# EAGLE design midiext-001 (EAGLE 8.6.3)
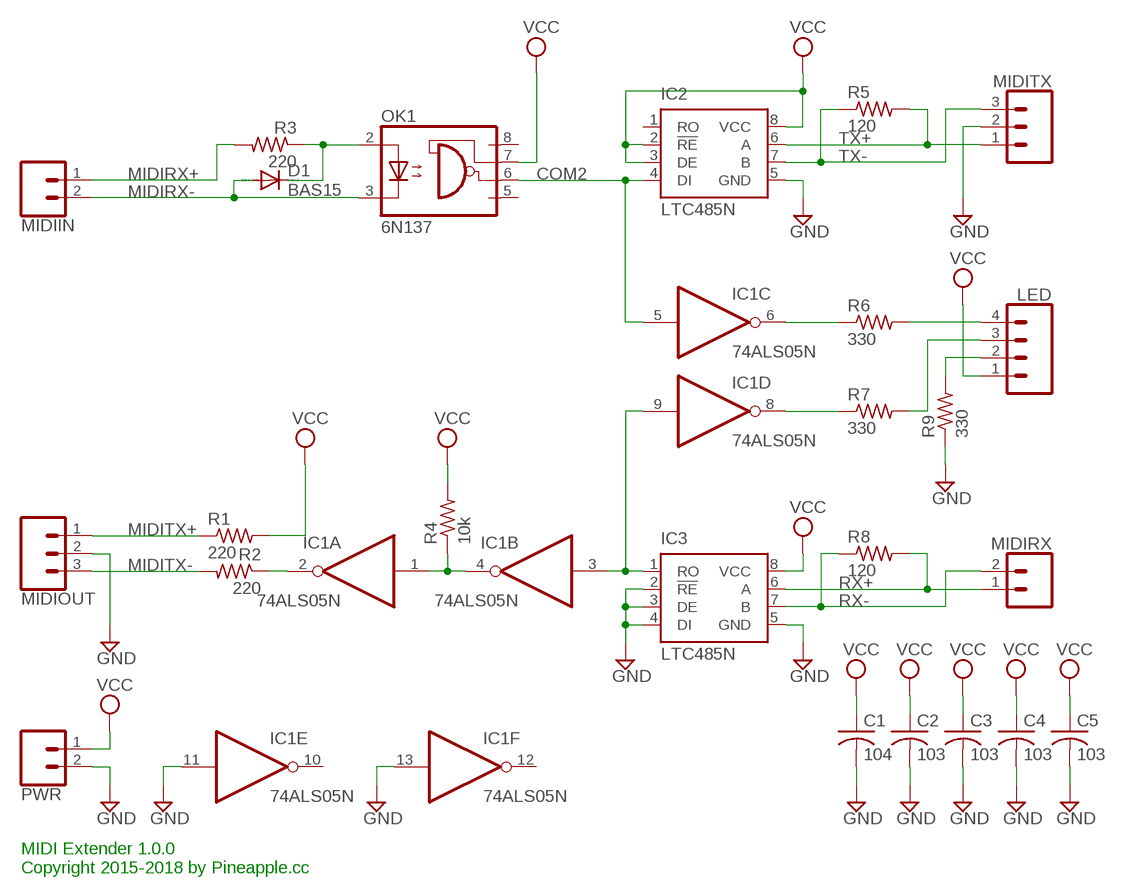
[diagram p0: schematic, sheet 1]

## Parts
C1  104  C-US025-025X050  [C025-025X050]
C2  103  C-US025-025X050  [C025-025X050]
C3  103  C-US025-025X050  [C025-025X050]
C4  103  C-US025-025X050  [C025-025X050]
C5  103  C-US025-025X050  [C025-025X050]
D1  BAS15  [DO34-7]
IC1  74ALS05N  [DIL14]
IC2  LTC485N  [DIL08]
IC3  LTC485N  [DIL08]
LED  CONN_04JST-PTH  [JST-4-PTH]
MIDIIN  CONN_02JST-PTH-2  [JST-2-PTH]
MIDIOUT  CONN_03JST-PTH  [JST-3-PTH]
MIDIRX  CONN_02JST-PTH-2  [JST-2-PTH]
MIDITX  CONN_03JST-PTH  [JST-3-PTH]
OK1  6N137  [DIL08]
PWR  CONN_02JST-PTH-2  [JST-2-PTH]
R1  220  R-US_0204/5  [0204/5]
R2  220  R-US_0204/5  [0204/5]
R3  220  R-US_0204/5  [0204/5]
R4  10k  R-US_0204/5  [0204/5]
R5  120  R-US_0204/5  [0204/5]
R6  330  R-US_0204/5  [0204/5]
R7  330  R-US_0204/5  [0204/5]
R8  120  R-US_0204/5  [0204/5]
R9  330  R-US_0204/5  [0204/5]

## Nets
COM2: IC1.5(C:I) IC2.4(DI) OK1.6(VO)
GND: C1.2 C2.2 C3.2 C4.2 C5.2 IC1.11(E:I) IC1.13(F:I) IC2.5(GND) IC3.2(!RE) IC3.3(DE) IC3.4(DI) IC3.5(GND) MIDIOUT.2 MIDITX.2 PWR.2 R9.1
MIDIRX+: MIDIIN.1 R3.2
MIDIRX-: D1.A MIDIIN.2 OK1.3(C)
MIDITX+: MIDIOUT.1 R1.1
MIDITX-: MIDIOUT.3 R2.2
N$1: IC1.3(B:I) IC1.9(D:I) IC3.1(RO)
N$2: IC1.2(A:O) R2.1
N$3: IC1.1(A:I) IC1.4(B:O) R4.1
N$6: IC1.6(C:O) R6.1
N$7: IC1.8(D:O) R7.1
N$8: LED.4 R6.2
N$9: LED.3 R7.2
N$10: LED.2 R9.2
N$15: D1.C OK1.2(A) R3.1
RX+: IC3.6(A) MIDIRX.1 R8.2
RX-: IC3.7(B) MIDIRX.2 R8.1
TX+: IC2.6(A) MIDITX.1 R5.2
TX-: IC2.7(B) MIDITX.3 R5.1
VCC: C1.1 C2.1 C3.1 C4.1 C5.1 IC2.2(!RE) IC2.3(DE) IC2.8(VCC) IC3.8(VCC) LED.1 OK1.7(VE) PWR.1 R1.2 R4.2
Unconnected: IC1.10(E:O) IC1.12(F:O) IC2.1(RO) OK1.5(GND) OK1.8(VCC)

## Notes on the sheet
- MIDI Extender 1.0.0
  Copyright 2015-2018 by Pineapple.cc

## Power pins joined to a net without a drawn wire
GND: IC1.7(P:GND)
VCC: IC1.14(P:VCC)

## Library data of the parts
C1-C5 = rcl:C-US: CAPACITOR, American symbol; SPICEPREFIX: C
D1 = diode:BAS15: DIODE high speed
IC1 = 74xx-eu:74*05: Hex INVERTER, open collector
IC2 IC3 = linear-technology:LTC485: Low Power RS485 Interface Transceiver Source: http://www.linear.com/pc/downloadDocument.do?navId=H0,C1,C1007,C1017,P2064,D1718; OC_FARNELL: unknown; OC_NEWARK: unknown
LED = SparkFun-Connectors:CONN_04: Multi connection point. Often used as Generic Header-pin footprint for 0.1 inch spaced/style header connections On any of the 0.1 inch spaced packages, you can populate with these: Break Away Headers - Straight <https://www.sparkfun.com/products/116> (PRT-00116) Break Away Male Headers - Right Angle <https://www.sparkfun.com/products/553> (PRT-00553) Female Headers <https://www.sparkfun.com/products/115> (PRT-00115) Break Away Headers - Machine Pin <https://www.sparkfun.com/products/117> (PRT-00117) Break Away Female Headers - Swiss Machine Pin <https://www.sparkfun.com/products/743> (PRT-00743) For SCREWTERMINALS and SPRING TERMINALS visit here: Screw Terimnals on SparkFun.com <https://www.sparkfun.com/search/results?term=Screw+Terminals> (5mm/3.5mm/2.54mm spacing) This device is also useful as a general connection point to wire up your design to another part of your project. Our various solder wires solder well into these plated through hole pads. Hook-Up Wire - Assortment (Stranded, 22 AWG) <https://www.sparkfun.com/products/11375> (PRT-11375) Hook-Up Wire - Assortment (Solid Core, 22 AWG) <https://www.sparkfun.com/products/11367> (PRT-11367) View the entire wire category on our website here <https://www.sparkfun.com/categories/141> Special notes: Molex polarized connector foot print use with SKU : PRT-08231 with associated crimp pins and housings. 1MM SMD Version SKU: PRT-10208; PROD_ID: WIRE-13531; SF_ID: PRT-09916
MIDIIN MIDIRX PWR = SparkFun-Connectors:CONN_02: Multi connection point. Often used as Generic Header-pin footprint for 0.1 inch spaced/style header connections On any of the 0.1 inch spaced packages, you can populate with these: Break Away Headers - Straight <https://www.sparkfun.com/products/116> (PRT-00116) Break Away Male Headers - Right Angle <https://www.sparkfun.com/products/553> (PRT-00553) Female Headers <https://www.sparkfun.com/products/115> (PRT-00115) Break Away Headers - Machine Pin <https://www.sparkfun.com/products/117> (PRT-00117) Break Away Female Headers - Swiss Machine Pin <https://www.sparkfun.com/products/743> (PRT-00743) For SCREWTERMINALS and SPRING TERMINALS visit here: Screw Terimnals on SparkFun.com <https://www.sparkfun.com/search/results?term=Screw+Terminals> (5mm/3.5mm/2.54mm spacing) This device is also useful as a general connection point to wire up your design to another part of your project. Our various solder wires solder well into these plated through hole pads. Hook-Up Wire - Assortment (Stranded, 22 AWG) <https://www.sparkfun.com/products/11375> (PRT-11375) Hook-Up Wire - Assortment (Solid Core, 22 AWG) <https://www.sparkfun.com/products/11367> (PRT-11367) View the entire wire category on our website here <https://www.sparkfun.com/categories/141> Special notes: Molex polarized connector foot print use with: PRT-08233 with associated crimp pins and housings. 2.54_SCREWTERM for use with PRT-10571. 3.5mm Screw Terminal footprints for PRT-08084 5mm Screw Terminal footprints for use with PRT-08432; PROD_ID: CONN-09863; SKU: PRT-09914
MIDIOUT MIDITX = SparkFun-Connectors:CONN_03: Multi connection point. Often used as Generic Header-pin footprint for 0.1 inch spaced/style header connections On any of the 0.1 inch spaced packages, you can populate with these: Break Away Headers - Straight <https://www.sparkfun.com/products/116> (PRT-00116) Break Away Male Headers - Right Angle <https://www.sparkfun.com/products/553> (PRT-00553) Female Headers <https://www.sparkfun.com/products/115> (PRT-00115) Break Away Headers - Machine Pin <https://www.sparkfun.com/products/117> (PRT-00117) Break Away Female Headers - Swiss Machine Pin <https://www.sparkfun.com/products/743> (PRT-00743) Stackable Header - 3 Pin (Female, 0.1") <https://www.sparkfun.com/products/13875> (PRT-13875) For SCREWTERMINALS and SPRING TERMINALS visit here: Screw Terimnals on SparkFun.com <https://www.sparkfun.com/search/results?term=Screw+Terminals> (5mm/3.5mm/2.54mm spacing) This device is also useful as a general connection point to wire up your design to another part of your project. Our various solder wires solder well into these plated through hole pads. Hook-Up Wire - Assortment (Stranded, 22 AWG) <https://www.sparkfun.com/products/11375> (PRT-11375) Hook-Up Wire - Assortment (Solid Core, 22 AWG) <https://www.sparkfun.com/products/11367> (PRT-11367) View the entire wire category on our website here <https://www.sparkfun.com/categories/141> Special notes: Molex polarized connector foot print use with SKU : PRT-08232 with associated crimp pins and housings.; PROD_ID: WIRE-10037; SF_ID: PRT-09915
OK1 = optocoupler:6N137: MOTOROLA OPTO COUPLER; MPN: 6N137; OC_FARNELL: 1328376; OC_NEWARK: 52M1895
R1-R9 = resistor:R-US_: RESISTOR, American symbol

## Board
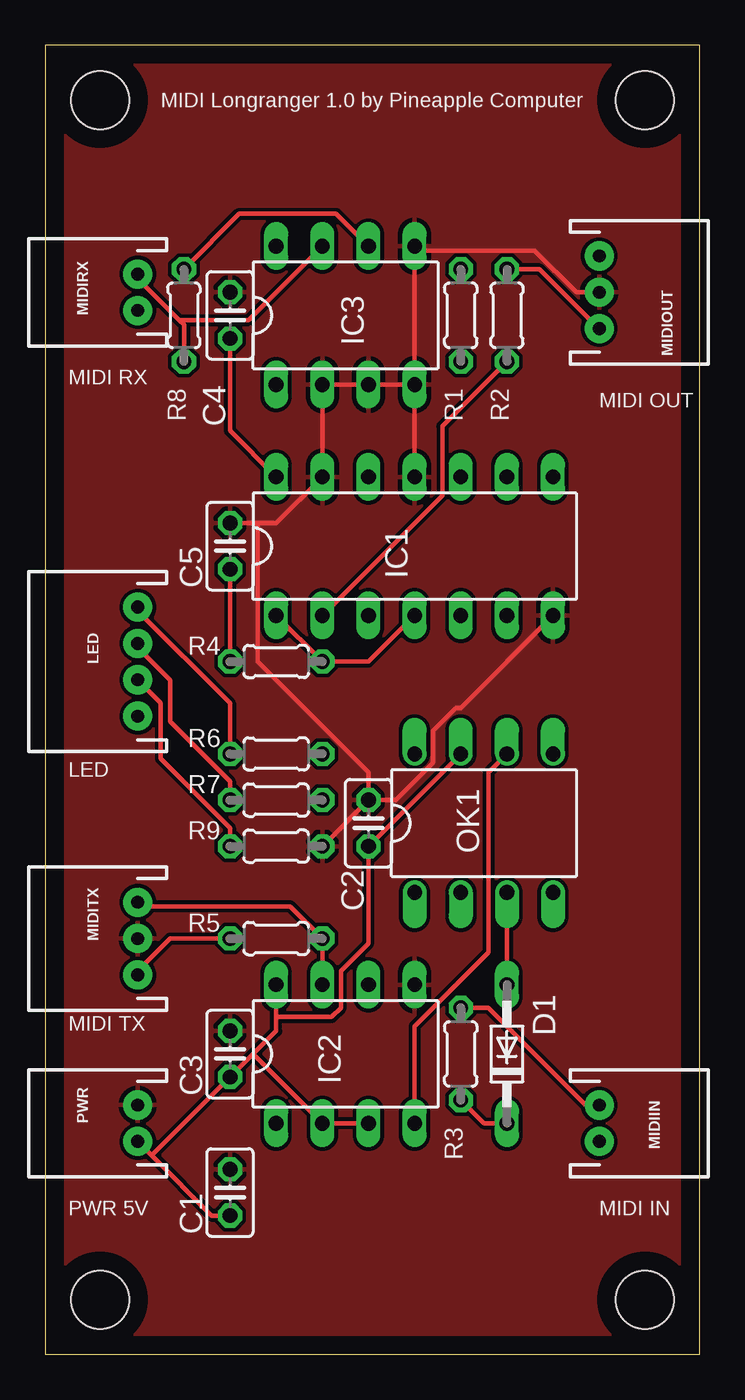
[diagram p1: board, top side]
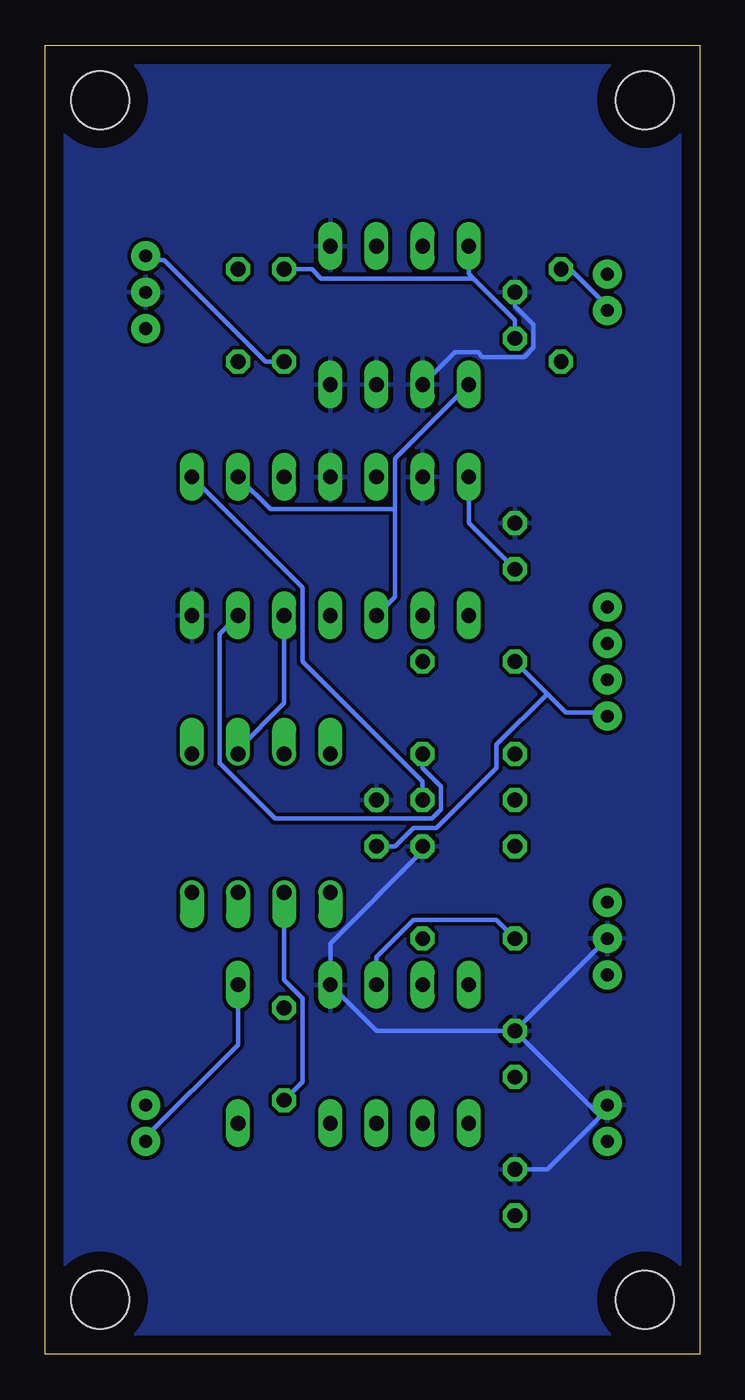
[diagram p2: board, bottom side, seen from below]

Size 36 x 72 mm. Coordinates in mm from the lower left corner, seen from the top.
Outline: 0,0 36,0 36,72 0,72 0,0
Copper layers (1*16): Top 0.035mm / dielectric 1.5mm / Bottom 0.035mm
Design rules "default": minimum track width 10mil, minimum drill 24mil, track to track 8mil, track to pad 8mil, pad to pad 8mil, via to via 8mil, smd to smd 8mil, copper to edge 40mil, drill to drill 8mil, minimum pad ring 10mil, minimum via ring 8mil, stop-mask expansion 4mil, vias tented up to drill 0mil, thermal gap 10mil
Holes 3.2 mm at 3,3 33,3 33,69 3,69

### Footprints (pad centres in the part's own frame; a part is rotated, then mirrored left to right if it is on the bottom)
C025-025X050 = drill 0.813 octagon: 1 -1.27,0; 2 1.27,0
DO34-7 = drill 0.813 long: A 3.81,0; C -3.81,0
DIL14 = drill 0.813 long: 1 -7.62,-3.81; 2 -5.08,-3.81; 3 -2.54,-3.81; 4 0,-3.81; 5 2.54,-3.81; 6 5.08,-3.81; 7 7.62,-3.81; 8 7.62,3.81; 9 5.08,3.81; 10 2.54,3.81; 11 0,3.81; 12 -2.54,3.81; 13 -5.08,3.81; 14 -7.62,3.81
DIL08 = drill 0.813 long: 1 -3.81,-3.81; 2 -1.27,-3.81; 3 1.27,-3.81; 4 3.81,-3.81; 5 3.81,3.81; 6 1.27,3.81; 7 -1.27,3.81; 8 -3.81,3.81
JST-4-PTH = drill 0.7 pad 1.6: 1 -3,0; 2 -1,0; 3 1,0; 4 3,0
JST-2-PTH = drill 0.7 pad 1.6: 1 -1,0; 2 1,0
JST-3-PTH = drill 0.7 pad 1.6: 1 -2,0; 2 0,0; 3 2,0
DIL08' = drill 0.813 offset: 1 -3.81,-3.81; 2 -1.27,-3.81; 3 1.27,-3.81; 4 3.81,-3.81; 5 3.81,3.81; 6 1.27,3.81; 7 -1.27,3.81; 8 -3.81,3.81
0204/5 = drill 0.813 octagon: 1 -2.54,0; 2 2.54,0

### Placement (x,y rotation side)
C1  10.16,8.89 90 top
C2  17.78,29.21 90 top
C3  10.16,16.51 90 top
C4  10.16,57.15 90 top
C5  10.16,44.45 90 top
D1  25.4,16.51 90 top
IC1  20.32,44.45 0 top
IC2  16.51,16.51 0 top
IC3  16.51,57.15 0 top
LED  5.08,38.1 90 top
MIDIIN  30.48,12.7 270 top
MIDIOUT  30.48,58.42 270 top
MIDIRX  5.08,58.42 90 top
MIDITX  5.08,22.86 90 top
OK1  6N137  [DIL08']  24.13,29.21 0 top
PWR  5.08,12.7 90 top
R1  22.86,57.15 90 top
R2  25.4,57.15 90 top
R3  22.86,16.51 90 top
R4  12.7,38.1 180 top
R5  12.7,22.86 180 top
R6  12.7,33.02 180 top
R7  12.7,30.48 180 top
R8  7.62,57.15 90 top
R9  12.7,27.94 180 top

### Tracks (layer width: path | path; a pad name or v marks a point on that pad's centre or on a via)
COM2
  Top 0.254: IC2.4 20.32,18.03 24.38,22.1 24.38,32 OK1.6
  Bottom 0.254: IC1.5 22.86,35.81 25.4,33.27 OK1.6
GND
  Top 0.254: 11.68,45.72 12.7,45.72 IC1.13 IC3.2 IC3.3 IC3.4 | 11.68,45.72 C5.2 | IC3.4 IC1.11 | IC3.4 20.32,60.71 | MIDIOUT.2 29.21,58.42 26.92,60.71 20.32,60.71 | 20.32,60.71 IC3.5 | R9.1 C2.2 | IC1.7 22.86,35.56 22.61,35.56 21.34,34.29 21.34,32.51 19.3,30.48 C2.2 | 11.68,45.72 11.68,38.1 17.78,32 C2.2
  Bottom 0.254: C4.2 10.16,57.66 9.14,56.64 9.14,55.37 9.65,54.86 11.94,54.86 12.19,55.12 13.46,55.12 IC3.2 | C1.2 8.38,10.16 5.33,13.21 | 5.33,13.21 5.08,13.46 PWR.2 5.33,13.21 | C3.2 5.59,13.21 5.33,13.21 | C3.2 MIDITX.2 | R9.1 15.24,27.69 20.32,22.61 IC2.5 17.78,17.78 C3.2
  pour Bottom: 0,0 36,0 36,72 0,72
  pour Top: 0,0 36,0 36,72 0,72
MIDIRX+
  Top 0.254: R3.2 24.38,19.05 29.72,13.72 30.48,13.72 MIDIIN.1
MIDIRX-
  Top 0.254: OK1.3 D1.A
  Bottom 0.254: D1.A 25.4,17.02 30.48,11.94 MIDIIN.2
MIDITX+
  Bottom 0.254: R1.1 23.88,54.61 29.46,60.2 30.48,60.2 MIDIOUT.1
MIDITX-
  Top 0.254: R2.2 27.18,59.69 30.48,56.39 MIDIOUT.3
N$1
  Bottom 0.254: IC3.1 16.76,49.28 16.76,46.48 | 16.76,46.48 16.76,41.66 IC1.3 | IC1.9 23.62,46.48 16.76,46.48
N$2
  Top 0.254: IC1.2 21.84,47.24 21.84,51.05 R2.1
N$3
  Top 0.254: IC1.1 R4.1 17.78,38.1 IC1.4
N$6
  Bottom 0.254: R6.1 15.24,32.26 14.22,31.24 14.22,29.97 14.73,29.46 23.37,29.46 26.42,32.51 26.42,39.62 IC1.6
N$7
  Bottom 0.254: R7.1 15.24,31.5 21.84,38.1 21.84,42.16 IC1.8
N$8
  Top 0.254: R6.2 10.16,35.81 5.08,40.89 LED.4
N$9
  Top 0.254: R7.2 10.16,31.5 6.86,34.8 6.86,37.08 5.08,38.86 LED.3
N$10
  Top 0.254: R9.2 10.16,28.96 6.35,32.77 6.35,35.81 5.08,37.08 LED.2
N$15
  Top 0.254: D1.C 24.13,12.7 R3.1
  Bottom 0.254: OK1.2 22.86,20.57 21.84,19.56 21.84,14.99 R3.1
RX+
  Top 0.254: IC3.6 16,62.74 10.67,62.74 R8.2
  Bottom 0.254: R8.2 7.11,59.69 5.08,57.66 MIDIRX.1
RX-
  Top 0.254: R8.1 7.62,56.64 7.37,56.9 | 7.37,56.9 5.08,59.18 MIDIRX.2 | IC3.7 11.18,56.9 7.37,56.9
TX+
  Top 0.254: R5.2 6.86,22.86 5.08,21.08 MIDITX.1
  Bottom 0.254: IC2.6 17.78,21.84 15.75,23.88 11.18,23.88 R5.2
TX-
  Top 0.254: IC2.7 R5.1 13.46,24.64 5.08,24.64 MIDITX.3
VCC
  Top 0.254: OK1.7 C2.1 17.78,22.61 16.26,21.08 16.26,19.05 15.75,18.54 12.7,18.54 | IC2.3 IC2.2 11.43,16.51 | C1.1 9.14,7.62 5.84,10.92 | 5.84,10.92 5.08,11.68 PWR.1 | 5.84,10.92 C3.1 11.43,16.51 | 12.7,18.54 12.7,17.78 11.43,16.51 | 12.7,18.54 IC2.8 | C5.1 R4.2 | C4.1 10.16,50.8 IC1.14
  Bottom 0.254: C4.1 10.16,56.9 12.45,59.18 | 12.45,59.18 12.7,59.44 IC3.8 | R1.2 21.34,59.69 20.83,59.18 12.45,59.18 | IC1.14 12.7,45.72 C5.1 | R4.2 8.38,36.32 | 8.38,36.32 7.37,35.31 5.08,35.31 LED.1 | C2.1 16.76,27.94 15.75,28.96 14.48,28.96 11.18,32.26 11.18,33.53 8.38,36.32

### Text on the board
tNames: MIDI Longranger 1.0 by Pineapple Computer | MIDI RX | MIDI OUT | LED | MIDI TX | PWR 5V | MIDI IN